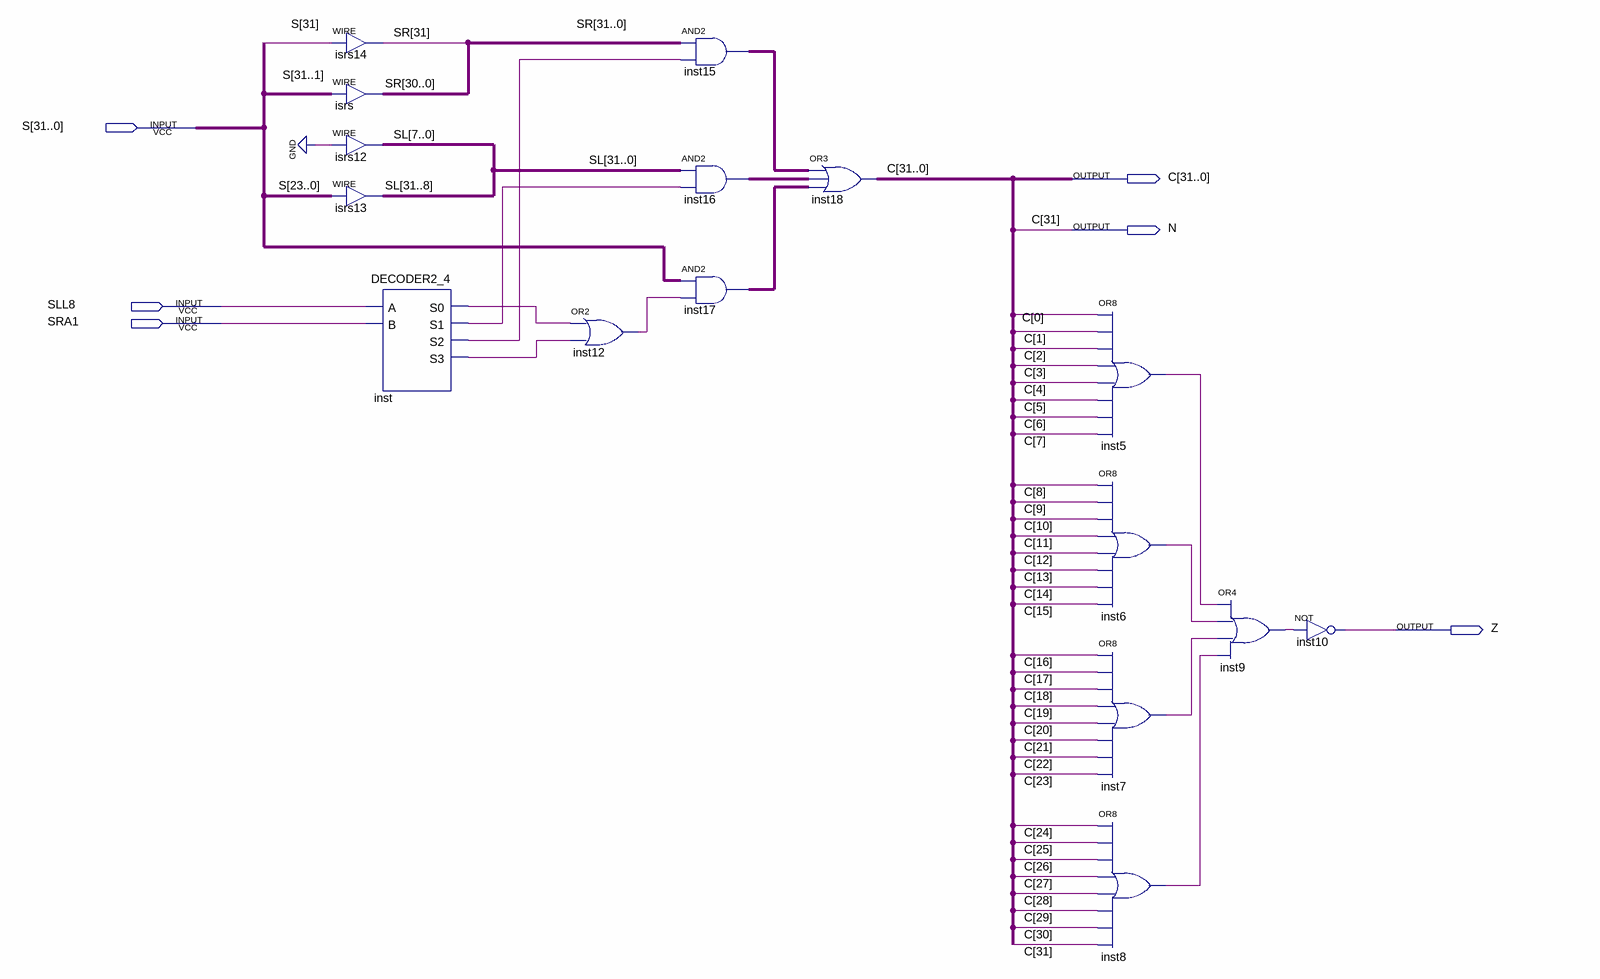
[diagram p0: schematic sheet]
// Quartus schematic shifter.bdf as structural Verilog: 16 symbols, 6 pins
module shifter (
  input  [31:0] S,
  input  SLL8,
  input  SRA1,
  output [31:0] C,
  output N,
  output Z
);

  wire inst5_out, inst6_out, inst7_out, inst8_out, inst9_out, inst12_out, inst_s0, inst_s1, inst_s2, inst_s3;
  wire [31:0] inst15_out, inst16_out, inst17_out, SL, SR;

  assign SR[31] = S[31];  // WIRE isrs14
  assign SR[30:0] = S[31:1];  // WIRE isrs
  assign SL[7:0] = {8{1'b0}};  // WIRE isrs12
  assign SL[31:8] = S[23:0];  // WIRE isrs13
  DECODER2_4 inst (.A(SLL8), .B(SRA1), .S0(inst_s0), .S1(inst_s1), .S2(inst_s2), .S3(inst_s3));
  or inst12 (inst12_out, inst_s0, inst_s3);
  assign inst15_out = SR & {32{inst_s2}};  // AND2 inst15, 32 bits wide
  assign inst16_out = SL & {32{inst_s1}};  // AND2 inst16, 32 bits wide
  assign inst17_out = S & {32{inst12_out}};  // AND2 inst17, 32 bits wide
  assign C = inst15_out | inst16_out | inst17_out;  // OR3 inst18, 32 bits wide
  or inst5 (inst5_out, C[0], C[1], C[2], C[3], C[4], C[5], C[6], C[7]);
  or inst6 (inst6_out, C[8], C[9], C[10], C[11], C[12], C[13], C[14], C[15]);
  or inst7 (inst7_out, C[16], C[17], C[18], C[19], C[20], C[21], C[22], C[23]);
  or inst8 (inst8_out, C[24], C[25], C[26], C[27], C[28], C[29], C[30], C[31]);
  or inst9 (inst9_out, inst5_out, inst6_out, inst7_out, inst8_out);
  not inst10 (Z, inst9_out);

  assign N = C[31];
endmodule
